# EasyEDA Pro project 磁感应板-2.0.eprj

# Schematic Schematic1
Create Date: 2023-02-28; Page Name: P1; Project Name: 磁感应板; Schematic Name: Schematic1; Update Date: 2023-02-28
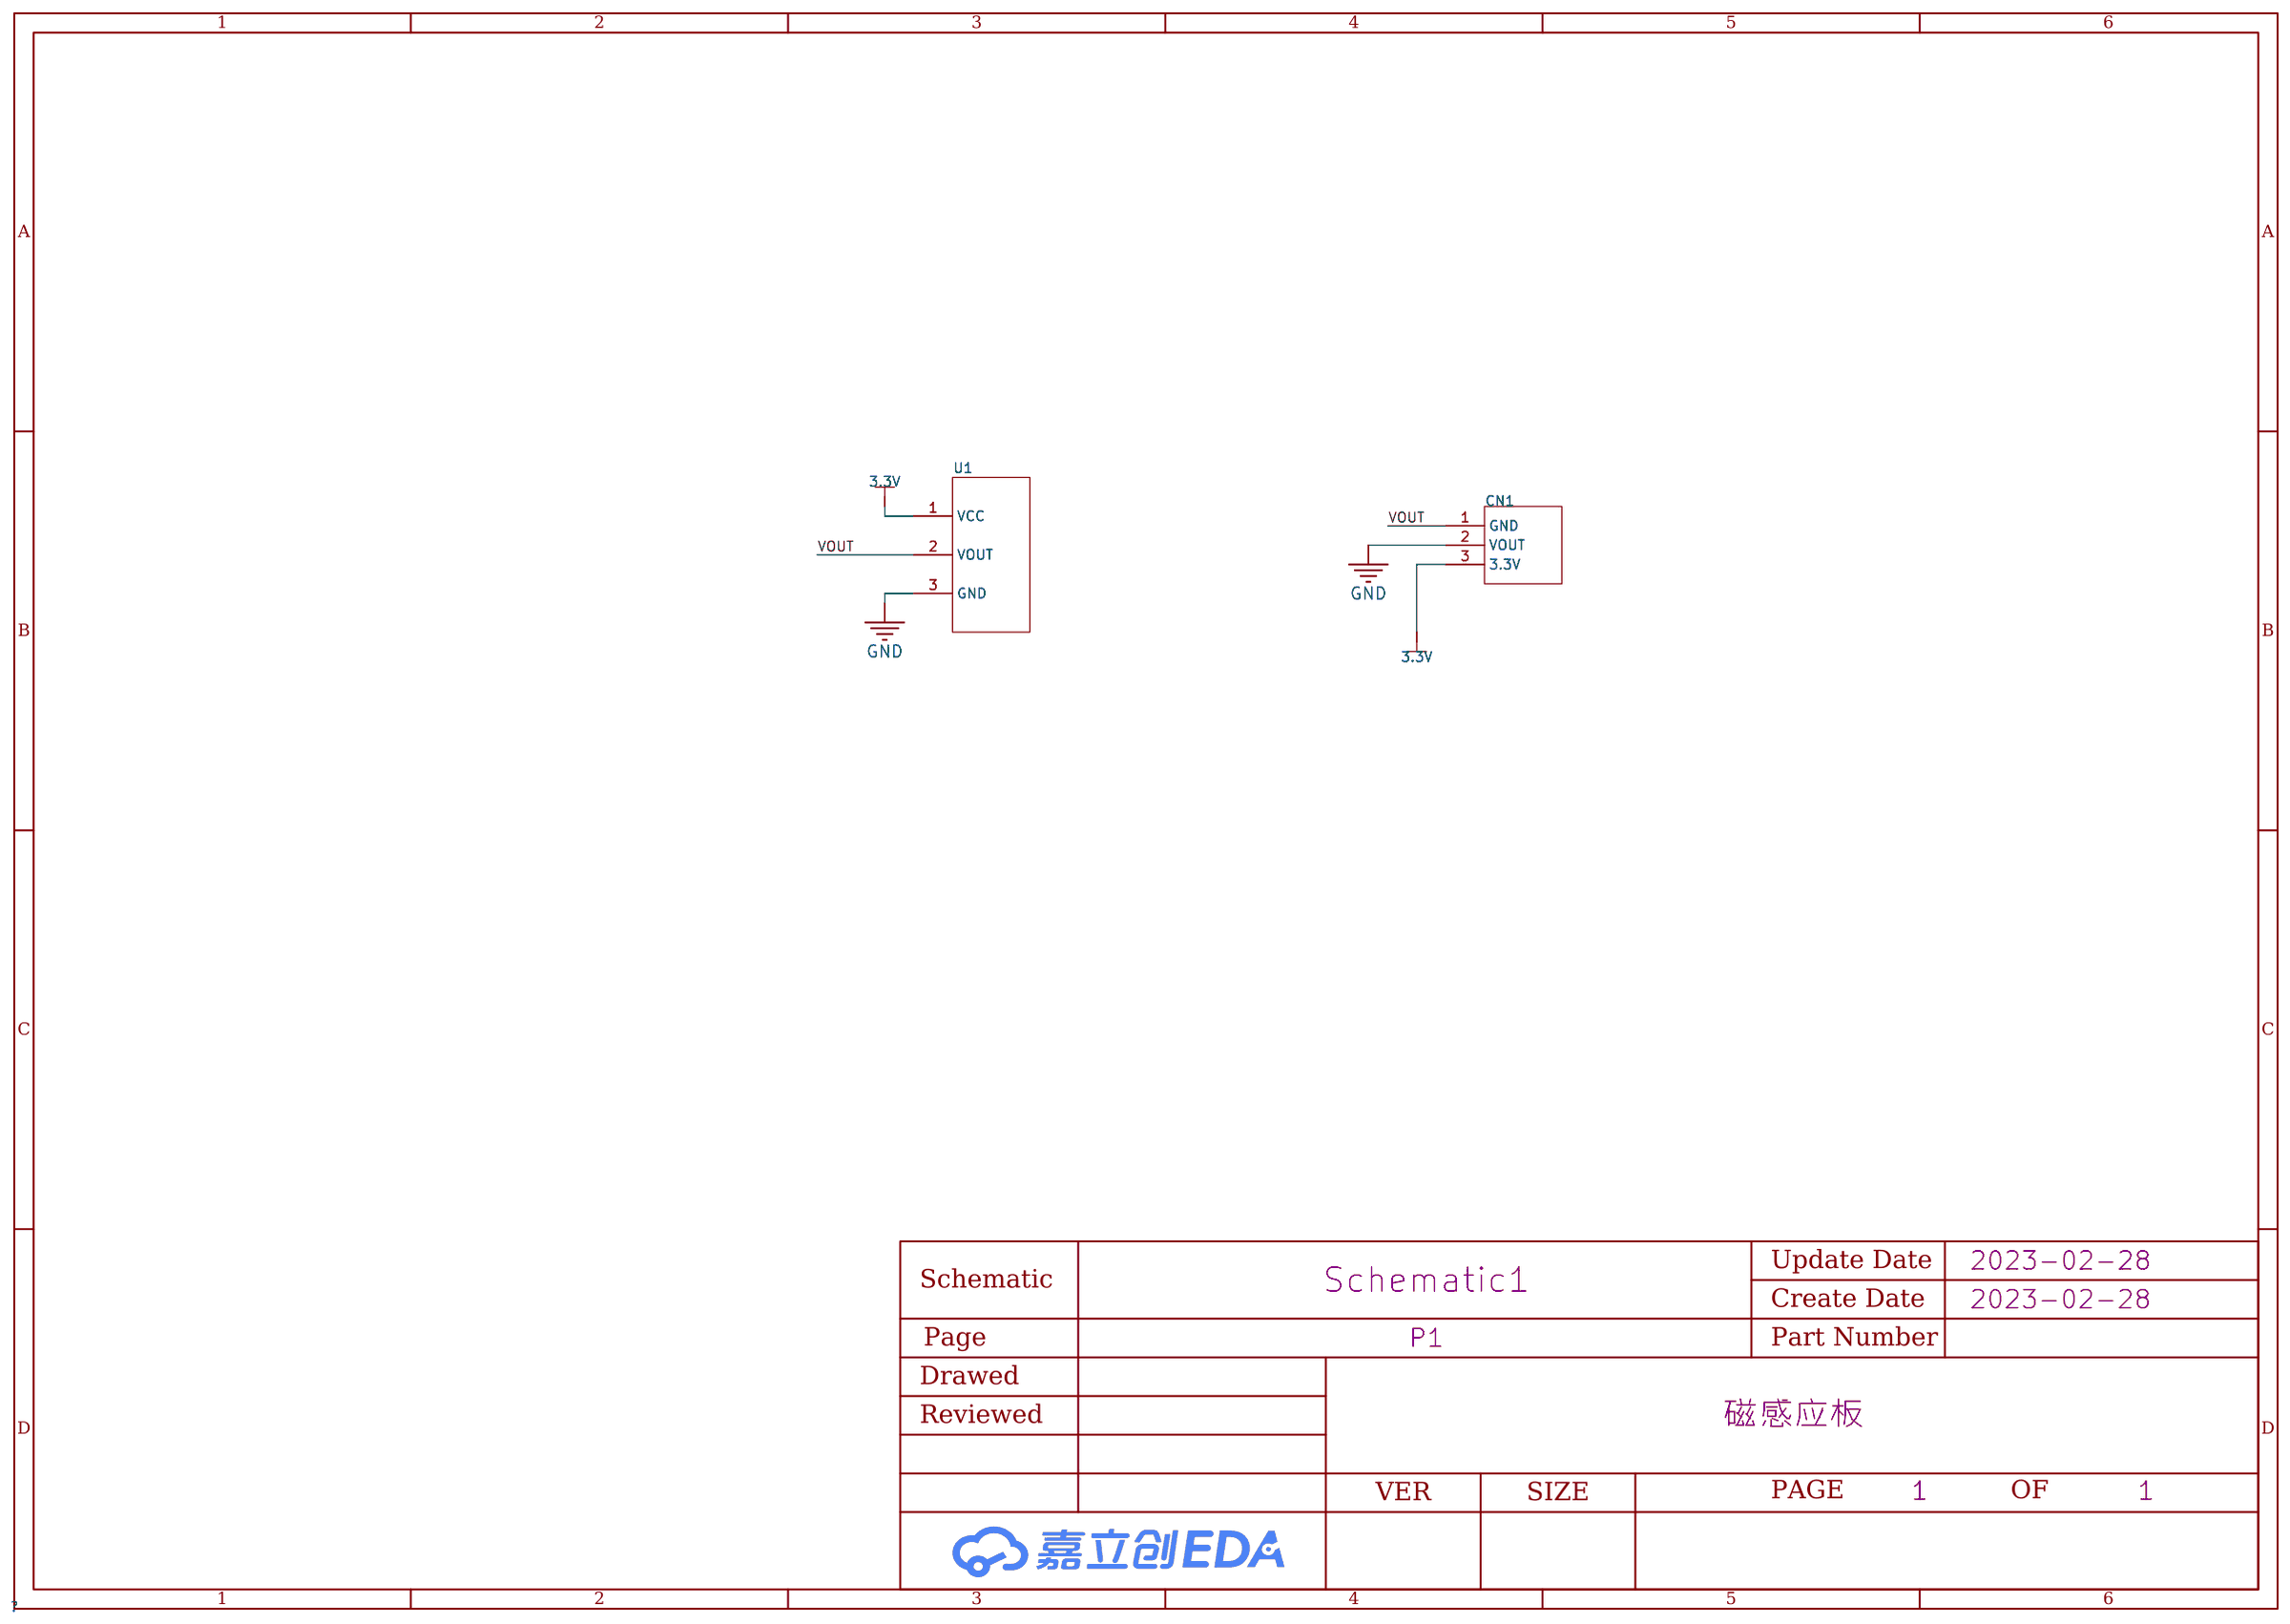
[diagram p0: schematic sheet]

## Parts
CN1  -  [3POINT]
U1  -  [SOT-23-3_L2.9-W1.3-P1.90-LS2.4]

## Library data of the parts
CN1 = 3POINT
U1 = MRS-201

## Nets
3.3V: CN1.3(3.3V) U1.1(VCC)
GND: CN1.2(VOUT) U1.3(GND)
VOUT: CN1.1(GND) U1.2(VOUT)

# Board PCB1
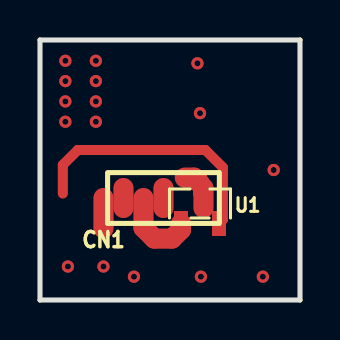
[diagram p1: board, top side]
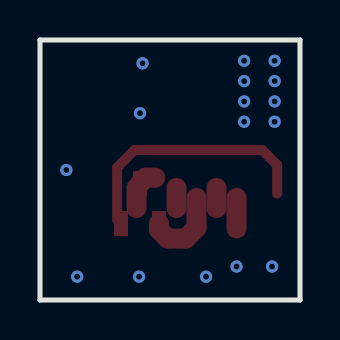
[diagram p2: board, bottom side, seen from below]

Outline 13 x 13 mm; copper layers: Top Layer, Bottom Layer. Coordinates in mm from the lower left corner of the outline.
Outline path: 0,13 0,0 13,0 13,13 0,13
Stack: Top Layer 0.035mm / Dielectric1 1.51mm FR4 er 4.5 / Bottom Layer 0.035mm

## Design rules (mm)
spacing safeClearance (default): track to track 0.152, other pairs 0.152 to 0.3
track width trackWidth (default): min 0.127, default 0.254, max 2.54
differential pair differentialPair (default): width min 0.127, default 0.254, max 2.54; gap min 0.152, default 0.152
via viaSize (default): diameter min 0.5, default 0.61, max 10; hole min 0.3, default 0.305, max 6

## Placement (name value [footprint] x y rotation side)
CN1  -  [3POINT]  3.17 5.1 0 top
U1  -  [SOT-23-3_L2.9-W1.3-P1.90-LS2.4]  8 4.83 270 top

## Footprints (pads in the part's own frame, mm; a bottom-side part is the same pattern mirrored in y, then rotated)
3POINT
  oval 1x2 smd: 1(1,0) 2(3,0) 3(5,0)
SOT-23-3_L2.9-W1.3-P1.90-LS2.4
  rect 1.25x0.7 smd: 1(1,-0.95) 2(1,0.95) 3(-1,0)

## Nets
As in the schematic.

## Via types
v1: diameter 0.61, hole 0.305, Top Layer to Bottom Layer, 16 vias

## Routing (per net, layer and track width the routed paths; a pad name or vN(x,y) marks a point on that pad's centre or on a via; arc(x,y) is an arc through that point)
3.3V: length 4.1
  Top Layer w1: U1.1 7.05,3.52 6.6,3.07 5.71,3.07 5.17,3.61 5.17,5.1
GND: length 2.4
  Top Layer w1: 7.24,6.12 7.71,6.12 U1.3 ; 3.17,5.1 3.17,3.58
  vias: v1(1.27,11.96) v1(1.27,10.94) v1(1.27,9.93) v1(1.27,8.91) v1(1.4,1.67) v1(2.79,11.96) v1(2.79,10.94) v1(2.79,9.93) v1(2.79,8.91) v1(3.17,1.67) v1(4.7,1.17) v1(7.87,11.83) v1(8,9.34) v1(8.05,1.17) v1(11.14,1.17) v1(11.68,6.5)
VOUT: length 13
  Top Layer w0.5: 1.14,5.33 1.14,6.75 1.89,7.5 8.27,7.5 9.14,6.63 9.14,4.02 U1.2

## Copper pours and planes (outline as drawn; the poured copper is in the pictures)
GND on Top Layer: -1.4,13.48 14.6,13.48 14.6,-0.48 -1.4,-0.48
GND on Bottom Layer: -1.4,13.48 14.48,13.48 14.48,-0.36 -1.4,-0.36
